# EAGLE schematic ESP-Relay-Driver (EAGLE 9.6.2)
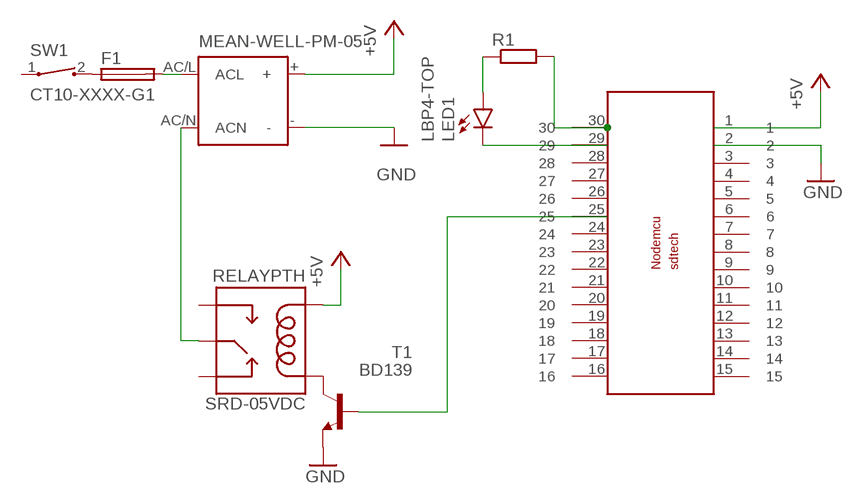
[diagram p0: schematic, sheet 1]

## Parts
F1  GSH15  [GSH15]
LED1  LBP4-TOP  [P47F-TOP]
MEAN-WELL-PM-05  PM-05  [PM-05]
R1  R-EU_0204/2V  [0204V]
SRD-05VDC  RELAYPTH  [SRD-05VDC-SL-C]
SW1  CT10-XXXX-G1  [CT10-XXXX-G1]
T1  BD139  [TO126]
U$1  NODEMCUESP8266  [NODEMCUESP8266]

## Nets
+5V: MEAN-WELL-PM-05.+ SRD-05VDC.COIL0 U$1.1
GND: MEAN-WELL-PM-05.- T1.1(E) U$1.2
N$1: T1.3(B) U$1.25
N$2: SRD-05VDC.COIL1 T1.2(C)
N$3: F1.2 MEAN-WELL-PM-05.AC/L(ACL)
N$4: MEAN-WELL-PM-05.AC/N(ACN) SRD-05VDC.SWCOMMON
N$5: F1.1 SW1.2
N$6: LED1.C U$1.29
N$7: R1.2 U$1.30
N$8: LED1.A R1.1
Unconnected: SRD-05VDC.SWCLOSED(SWCLOSE) SRD-05VDC.SWOPEN SW1.1 U$1.3 U$1.4 U$1.5 U$1.6 U$1.7 U$1.8 U$1.9 U$1.10 U$1.11 U$1.12 U$1.13 U$1.14 U$1.15 U$1.16 U$1.17 U$1.18 U$1.19 U$1.20 U$1.21 U$1.22 U$1.23 U$1.24 U$1.26 U$1.27 U$1.28

## Library data of the parts
F1 = fuse:GSH15: FUSE HOLDER grid 15mm, 19649 Wickmann; MPN: 64900001039; OC_FARNELL: 1271673; OC_NEWARK: 02P0318
LED1 = led:*P4: PointLED® Enhanced Thinfilm LED TOP & BOTTOM mount LS P47F, LR P47F, LA P47F, LY P47F, LT P4SG, LB P4SG, LW P4SG Source: http://catalog.osram-os.com .. LA_LR_LS_LY_P47F_Pb_free.pdf
MEAN-WELL-PM-05 = meanwell:PM-05: On Board Switching Power Supply 5W Output www.meanwell.com
R1 = rcl:R-EU_: RESISTOR, European symbol; SPICEPREFIX: R
SRD-05VDC = sdr-5vdc:RELAY: SPDT relay (COM-00101)
SW1 = switch-coto:CT10-XXXX-: CT10 Series Molded Switch Source: www.cotorelay.com .. Coto_Technology__CT10-1530-G1.pdf
T1 = transistor-neu-to92:BD139: NPN TRANSISTOR
U$1 = nodemcu:NODEMCUESP8266: Node Mcu esp8266 12E LIBRARY BY SDTECH ROBOTICS (Shubham Devkar Technology Solutions)